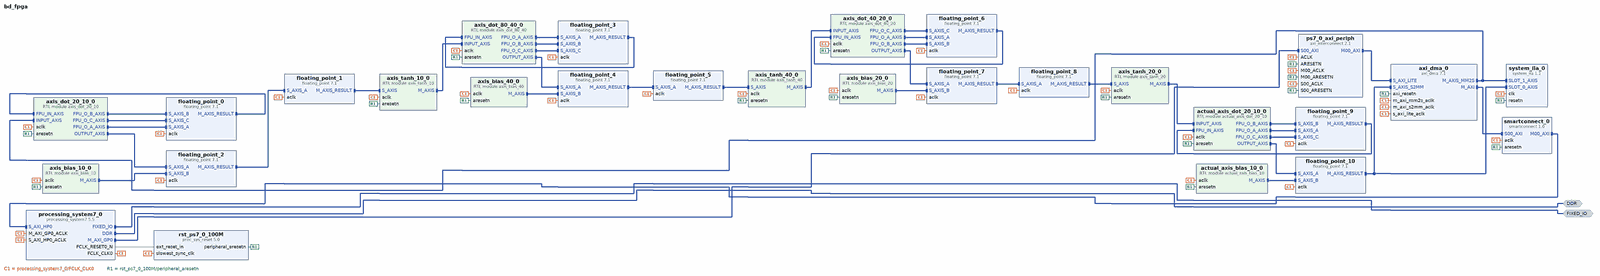
[diagram p0: block diagram of the top level, whole]
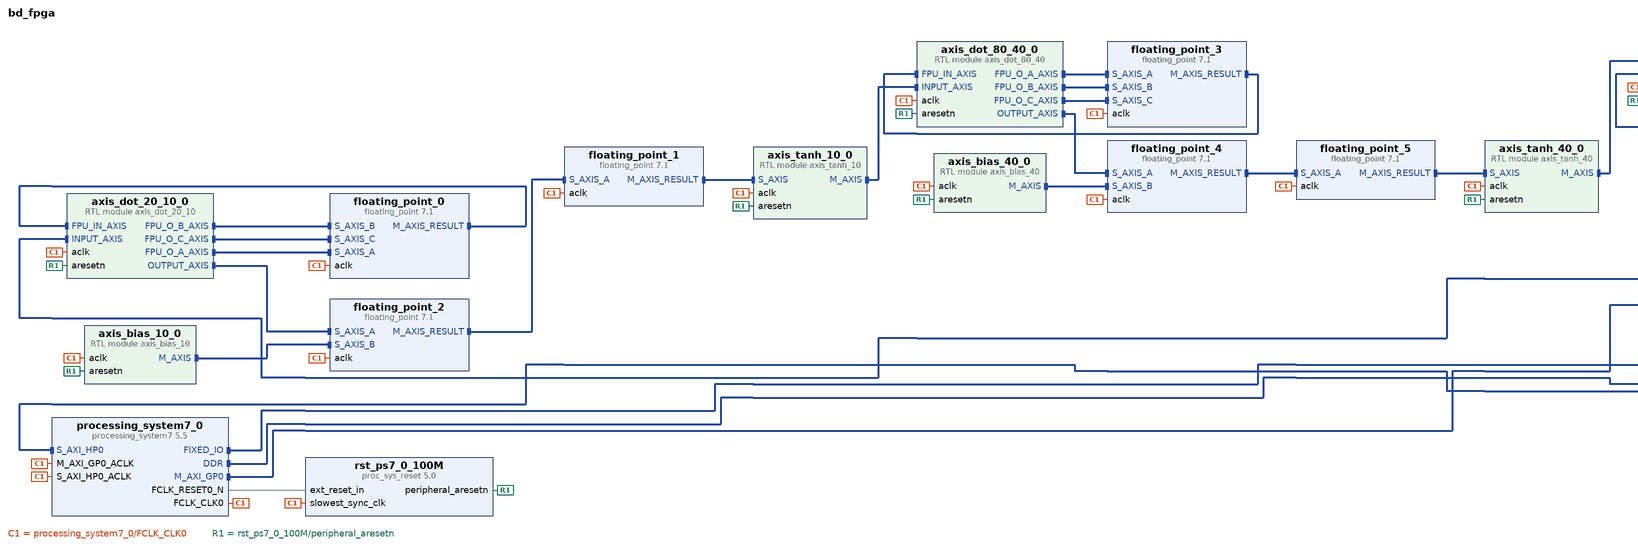
[diagram p1: block diagram of the top level, left part]
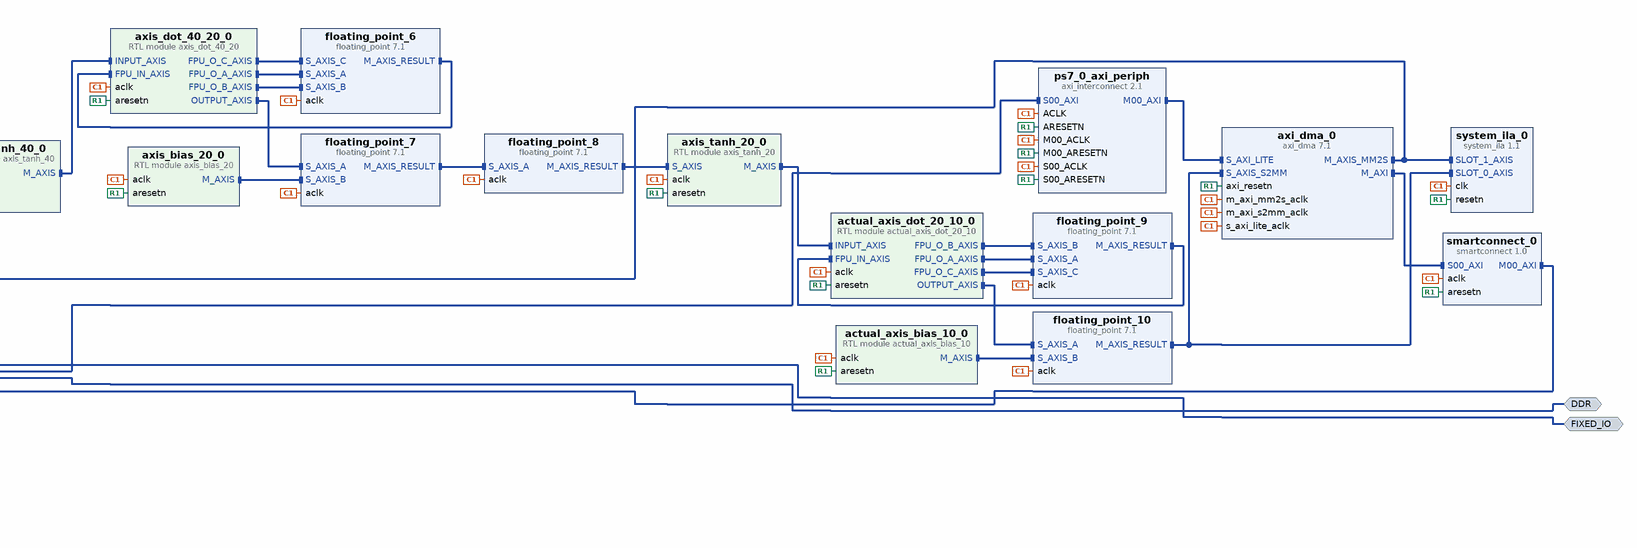
[diagram p2: block diagram of the top level, right part]
# Vivado block design bd_fpga, xc7z020clg400-1, Vivado 2018.3
create_bd_design bd_fpga

create_bd_intf_port -mode Master -vlnv xilinx.com:interface:ddrx_rtl:1.0 DDR
create_bd_intf_port -mode Master -vlnv xilinx.com:display_processing_system7:fixedio_rtl:1.0 FIXED_IO

create_bd_cell -type ip -vlnv xilinx.com:ip:processing_system7:5.5 processing_system7_0
set_property -dict [list \
  CONFIG.PCW_APU_PERIPHERAL_FREQMHZ 650 \
  CONFIG.PCW_CRYSTAL_PERIPHERAL_FREQMHZ 50 \
  CONFIG.PCW_ENET0_ENET0_IO {MIO 16 .. 27} \
  CONFIG.PCW_ENET0_GRP_MDIO_ENABLE 1 \
  CONFIG.PCW_ENET0_GRP_MDIO_IO {MIO 52 .. 53} \
  CONFIG.PCW_ENET0_PERIPHERAL_ENABLE 1 \
  CONFIG.PCW_ENET0_RESET_ENABLE 1 \
  CONFIG.PCW_ENET0_RESET_IO {MIO 9} \
  CONFIG.PCW_ENET_RESET_ENABLE 1 \
  CONFIG.PCW_ENET_RESET_SELECT {Share reset pin} \
  CONFIG.PCW_FPGA0_PERIPHERAL_FREQMHZ 100 \
  CONFIG.PCW_FPGA1_PERIPHERAL_FREQMHZ 50 \
  CONFIG.PCW_GPIO_MIO_GPIO_ENABLE 1 \
  CONFIG.PCW_GPIO_MIO_GPIO_IO MIO \
  CONFIG.PCW_I2C_RESET_ENABLE 1 \
  CONFIG.PCW_M_AXI_GP0_FREQMHZ 10 \
  CONFIG.PCW_PERIPHERAL_BOARD_PRESET None \
  CONFIG.PCW_PRESET_BANK1_VOLTAGE {LVCMOS 1.8V} \
  CONFIG.PCW_QSPI_GRP_FBCLK_ENABLE 1 \
  CONFIG.PCW_QSPI_GRP_FBCLK_IO {MIO 8} \
  CONFIG.PCW_QSPI_GRP_SINGLE_SS_ENABLE 1 \
  CONFIG.PCW_QSPI_GRP_SINGLE_SS_IO {MIO 1 .. 6} \
  CONFIG.PCW_QSPI_PERIPHERAL_ENABLE 1 \
  CONFIG.PCW_QSPI_QSPI_IO {MIO 1 .. 6} \
  CONFIG.PCW_SD0_GRP_CD_ENABLE 1 \
  CONFIG.PCW_SD0_GRP_CD_IO {MIO 47} \
  CONFIG.PCW_SD0_GRP_WP_ENABLE 0 \
  CONFIG.PCW_SD0_PERIPHERAL_ENABLE 1 \
  CONFIG.PCW_SD0_SD0_IO {MIO 40 .. 45} \
  CONFIG.PCW_SDIO_PERIPHERAL_FREQMHZ 50 \
  CONFIG.PCW_SINGLE_QSPI_DATA_MODE x4 \
  CONFIG.PCW_S_AXI_HP0_FREQMHZ 10 \
  CONFIG.PCW_UART0_PERIPHERAL_ENABLE 1 \
  CONFIG.PCW_UART0_UART0_IO {MIO 14 .. 15} \
  CONFIG.PCW_UART1_PERIPHERAL_ENABLE 0 \
  CONFIG.PCW_UART_PERIPHERAL_FREQMHZ 100 \
  CONFIG.PCW_UIPARAM_DDR_BUS_WIDTH {16 Bit} \
  CONFIG.PCW_UIPARAM_DDR_FREQ_MHZ 525 \
  CONFIG.PCW_UIPARAM_DDR_PARTNO {MT41J256M16 RE-125} \
  CONFIG.PCW_USB0_PERIPHERAL_ENABLE 1 \
  CONFIG.PCW_USB0_RESET_ENABLE 1 \
  CONFIG.PCW_USB0_RESET_IO {MIO 46} \
  CONFIG.PCW_USB0_USB0_IO {MIO 28 .. 39} \
  CONFIG.PCW_USB_RESET_ENABLE 1 \
  CONFIG.PCW_USB_RESET_SELECT {Share reset pin} \
  CONFIG.PCW_USE_S_AXI_HP0 1 \
] [get_bd_cells processing_system7_0]
# 482 more settings of processing_system7_0 are not shown: defaults, MIO pin electricals, DDR timing, and values the tool derives
create_bd_cell -type ip -vlnv xilinx.com:ip:floating_point:7.1 floating_point_0
set_property -dict [list \
  CONFIG.Add_Sub_Value Add \
  CONFIG.C_Latency 17 \
  CONFIG.C_Mult_Usage Medium_Usage \
  CONFIG.C_Rate 1 \
  CONFIG.C_Result_Exponent_Width 8 \
  CONFIG.C_Result_Fraction_Width 24 \
  CONFIG.Has_A_TLAST true \
  CONFIG.Operation_Type FMA \
  CONFIG.RESULT_TLAST_Behv Pass_A_TLAST \
  CONFIG.Result_Precision_Type Single \
] [get_bd_cells floating_point_0]
create_bd_cell -type ip -vlnv xilinx.com:ip:axi_dma:7.1 axi_dma_0
set_property -dict {CONFIG.c_include_sg 0 CONFIG.c_single_interface 1} [get_bd_cells axi_dma_0]
create_bd_cell -type ip -vlnv xilinx.com:ip:axi_interconnect:2.1 ps7_0_axi_periph
set_property -dict {CONFIG.NUM_MI 1} [get_bd_cells ps7_0_axi_periph]
create_bd_cell -type ip -vlnv xilinx.com:ip:proc_sys_reset:5.0 rst_ps7_0_100M
create_bd_cell -type ip -vlnv xilinx.com:ip:smartconnect:1.0 smartconnect_0
set_property -dict {CONFIG.NUM_SI 1} [get_bd_cells smartconnect_0]
create_bd_cell -type ip -vlnv xilinx.com:ip:system_ila:1.1 system_ila_0
set_property -dict [list \
  CONFIG.C_MON_TYPE INTERFACE \
  CONFIG.C_NUM_MONITOR_SLOTS 2 \
  CONFIG.C_SLOT_0_APC_EN 0 \
  CONFIG.C_SLOT_0_AXI_DATA_SEL 1 \
  CONFIG.C_SLOT_0_AXI_TRIG_SEL 1 \
  CONFIG.C_SLOT_0_INTF_TYPE xilinx.com:interface:axis_rtl:1.0 \
  CONFIG.C_SLOT_1_APC_EN 0 \
  CONFIG.C_SLOT_1_AXI_DATA_SEL 1 \
  CONFIG.C_SLOT_1_AXI_TRIG_SEL 1 \
  CONFIG.C_SLOT_1_INTF_TYPE xilinx.com:interface:axis_rtl:1.0 \
] [get_bd_cells system_ila_0]
create_bd_cell -type ip -vlnv xilinx.com:ip:floating_point:7.1 floating_point_2
set_property -dict [list \
  CONFIG.Add_Sub_Value Add \
  CONFIG.Has_A_TLAST true \
  CONFIG.RESULT_TLAST_Behv Pass_A_TLAST \
] [get_bd_cells floating_point_2]
create_bd_cell -type ip -vlnv xilinx.com:ip:floating_point:7.1 floating_point_1
set_property -dict [list \
  CONFIG.C_Accum_Input_Msb 32 \
  CONFIG.C_Accum_Lsb -31 \
  CONFIG.C_Accum_Msb 32 \
  CONFIG.C_Latency 7 \
  CONFIG.C_Mult_Usage No_Usage \
  CONFIG.C_Rate 1 \
  CONFIG.C_Result_Exponent_Width 16 \
  CONFIG.C_Result_Fraction_Width 16 \
  CONFIG.Flow_Control Blocking \
  CONFIG.Has_RESULT_TREADY true \
  CONFIG.Operation_Type Float_to_fixed \
  CONFIG.Result_Precision_Type Custom \
] [get_bd_cells floating_point_1]
create_bd_cell -type module -reference axis_dot_20_10 axis_dot_20_10_0
create_bd_cell -type module -reference axis_bias_10 axis_bias_10_0
create_bd_cell -type module -reference axis_tanh_10 axis_tanh_10_0
create_bd_cell -type module -reference axis_dot_80_40 axis_dot_80_40_0
create_bd_cell -type ip -vlnv xilinx.com:ip:floating_point:7.1 floating_point_3
set_property -dict [list \
  CONFIG.Add_Sub_Value Add \
  CONFIG.C_Latency 17 \
  CONFIG.C_Mult_Usage Medium_Usage \
  CONFIG.C_Rate 1 \
  CONFIG.C_Result_Exponent_Width 8 \
  CONFIG.C_Result_Fraction_Width 24 \
  CONFIG.Has_A_TLAST true \
  CONFIG.Operation_Type FMA \
  CONFIG.RESULT_TLAST_Behv Pass_A_TLAST \
  CONFIG.Result_Precision_Type Single \
] [get_bd_cells floating_point_3]
create_bd_cell -type module -reference axis_bias_40 axis_bias_40_0
create_bd_cell -type ip -vlnv xilinx.com:ip:floating_point:7.1 floating_point_4
set_property -dict [list \
  CONFIG.Add_Sub_Value Add \
  CONFIG.Has_A_TLAST true \
  CONFIG.RESULT_TLAST_Behv Pass_A_TLAST \
] [get_bd_cells floating_point_4]
create_bd_cell -type ip -vlnv xilinx.com:ip:floating_point:7.1 floating_point_5
set_property -dict [list \
  CONFIG.C_Accum_Input_Msb 32 \
  CONFIG.C_Accum_Lsb -31 \
  CONFIG.C_Accum_Msb 32 \
  CONFIG.C_Latency 7 \
  CONFIG.C_Mult_Usage No_Usage \
  CONFIG.C_Rate 1 \
  CONFIG.C_Result_Exponent_Width 16 \
  CONFIG.C_Result_Fraction_Width 16 \
  CONFIG.Flow_Control Blocking \
  CONFIG.Has_RESULT_TREADY true \
  CONFIG.Operation_Type Float_to_fixed \
  CONFIG.Result_Precision_Type Custom \
] [get_bd_cells floating_point_5]
create_bd_cell -type module -reference axis_tanh_40 axis_tanh_40_0
create_bd_cell -type module -reference axis_dot_40_20 axis_dot_40_20_0
create_bd_cell -type ip -vlnv xilinx.com:ip:floating_point:7.1 floating_point_6
set_property -dict [list \
  CONFIG.Add_Sub_Value Add \
  CONFIG.C_Latency 17 \
  CONFIG.C_Mult_Usage Medium_Usage \
  CONFIG.C_Rate 1 \
  CONFIG.C_Result_Exponent_Width 8 \
  CONFIG.C_Result_Fraction_Width 24 \
  CONFIG.Has_A_TLAST true \
  CONFIG.Operation_Type FMA \
  CONFIG.RESULT_TLAST_Behv Pass_A_TLAST \
  CONFIG.Result_Precision_Type Single \
] [get_bd_cells floating_point_6]
create_bd_cell -type ip -vlnv xilinx.com:ip:floating_point:7.1 floating_point_7
set_property -dict [list \
  CONFIG.Add_Sub_Value Add \
  CONFIG.Has_A_TLAST true \
  CONFIG.RESULT_TLAST_Behv Pass_A_TLAST \
] [get_bd_cells floating_point_7]
create_bd_cell -type ip -vlnv xilinx.com:ip:floating_point:7.1 floating_point_8
set_property -dict [list \
  CONFIG.C_Accum_Input_Msb 32 \
  CONFIG.C_Accum_Lsb -31 \
  CONFIG.C_Accum_Msb 32 \
  CONFIG.C_Latency 7 \
  CONFIG.C_Mult_Usage No_Usage \
  CONFIG.C_Rate 1 \
  CONFIG.C_Result_Exponent_Width 16 \
  CONFIG.C_Result_Fraction_Width 16 \
  CONFIG.Flow_Control Blocking \
  CONFIG.Has_RESULT_TREADY true \
  CONFIG.Operation_Type Float_to_fixed \
  CONFIG.Result_Precision_Type Custom \
] [get_bd_cells floating_point_8]
create_bd_cell -type module -reference axis_bias_20 axis_bias_20_0
create_bd_cell -type module -reference axis_tanh_20 axis_tanh_20_0
create_bd_cell -type module -reference actual_axis_dot_20_10 actual_axis_dot_20_10_0
create_bd_cell -type module -reference actual_axis_bias_10 actual_axis_bias_10_0
create_bd_cell -type ip -vlnv xilinx.com:ip:floating_point:7.1 floating_point_9
set_property -dict [list \
  CONFIG.Add_Sub_Value Add \
  CONFIG.C_Latency 17 \
  CONFIG.C_Mult_Usage Medium_Usage \
  CONFIG.C_Rate 1 \
  CONFIG.C_Result_Exponent_Width 8 \
  CONFIG.C_Result_Fraction_Width 24 \
  CONFIG.Has_A_TLAST true \
  CONFIG.Operation_Type FMA \
  CONFIG.RESULT_TLAST_Behv Pass_A_TLAST \
  CONFIG.Result_Precision_Type Single \
] [get_bd_cells floating_point_9]
create_bd_cell -type ip -vlnv xilinx.com:ip:floating_point:7.1 floating_point_10
set_property -dict [list \
  CONFIG.Add_Sub_Value Add \
  CONFIG.Has_A_TLAST true \
  CONFIG.RESULT_TLAST_Behv Pass_A_TLAST \
] [get_bd_cells floating_point_10]

# ---- connections ----

connect_bd_intf_net [get_bd_intf_pins axis_bias_10_0/M_AXIS] [get_bd_intf_pins floating_point_2/S_AXIS_B]
connect_bd_intf_net -intf_net axi_dma_0_M_AXIS_MM2S [get_bd_intf_pins axi_dma_0/M_AXIS_MM2S] [get_bd_intf_pins axis_dot_20_10_0/INPUT_AXIS]
connect_bd_intf_net [get_bd_intf_pins axi_dma_0/M_AXIS_MM2S] [get_bd_intf_pins system_ila_0/SLOT_1_AXIS]
connect_bd_intf_net [get_bd_intf_pins floating_point_2/M_AXIS_RESULT] [get_bd_intf_pins floating_point_1/S_AXIS_A]
connect_bd_intf_net [get_bd_intf_pins floating_point_0/M_AXIS_RESULT] [get_bd_intf_pins axis_dot_20_10_0/FPU_IN_AXIS]
connect_bd_intf_net [get_bd_intf_ports FIXED_IO] [get_bd_intf_pins processing_system7_0/FIXED_IO]
connect_bd_intf_net [get_bd_intf_pins ps7_0_axi_periph/M00_AXI] [get_bd_intf_pins axi_dma_0/S_AXI_LITE]
connect_bd_intf_net [get_bd_intf_pins axis_dot_20_10_0/OUTPUT_AXIS] [get_bd_intf_pins floating_point_2/S_AXIS_A]
connect_bd_intf_net [get_bd_intf_pins floating_point_1/M_AXIS_RESULT] [get_bd_intf_pins axis_tanh_10_0/S_AXIS]
connect_bd_intf_net [get_bd_intf_ports DDR] [get_bd_intf_pins processing_system7_0/DDR]
connect_bd_intf_net [get_bd_intf_pins processing_system7_0/M_AXI_GP0] [get_bd_intf_pins ps7_0_axi_periph/S00_AXI]
connect_bd_intf_net [get_bd_intf_pins axis_dot_20_10_0/FPU_O_B_AXIS] [get_bd_intf_pins floating_point_0/S_AXIS_B]
connect_bd_intf_net [get_bd_intf_pins axi_dma_0/M_AXI] [get_bd_intf_pins smartconnect_0/S00_AXI]
connect_bd_intf_net [get_bd_intf_pins axis_dot_20_10_0/FPU_O_C_AXIS] [get_bd_intf_pins floating_point_0/S_AXIS_C]
connect_bd_intf_net [get_bd_intf_pins smartconnect_0/M00_AXI] [get_bd_intf_pins processing_system7_0/S_AXI_HP0]
connect_bd_intf_net [get_bd_intf_pins axis_dot_20_10_0/FPU_O_A_AXIS] [get_bd_intf_pins floating_point_0/S_AXIS_A]
connect_bd_intf_net [get_bd_intf_pins actual_axis_dot_20_10_0/OUTPUT_AXIS] [get_bd_intf_pins floating_point_10/S_AXIS_A]
connect_bd_intf_net [get_bd_intf_pins actual_axis_bias_10_0/M_AXIS] [get_bd_intf_pins floating_point_10/S_AXIS_B]
connect_bd_intf_net [get_bd_intf_pins actual_axis_dot_20_10_0/INPUT_AXIS] [get_bd_intf_pins axis_tanh_20_0/M_AXIS]
connect_bd_intf_net [get_bd_intf_pins floating_point_5/M_AXIS_RESULT] [get_bd_intf_pins axis_tanh_40_0/S_AXIS]
connect_bd_intf_net [get_bd_intf_pins axis_dot_40_20_0/FPU_O_C_AXIS] [get_bd_intf_pins floating_point_6/S_AXIS_C]
connect_bd_intf_net [get_bd_intf_pins axis_bias_20_0/M_AXIS] [get_bd_intf_pins floating_point_7/S_AXIS_B]
connect_bd_intf_net [get_bd_intf_pins floating_point_4/M_AXIS_RESULT] [get_bd_intf_pins floating_point_5/S_AXIS_A]
connect_bd_intf_net [get_bd_intf_pins axis_dot_80_40_0/OUTPUT_AXIS] [get_bd_intf_pins floating_point_4/S_AXIS_A]
connect_bd_intf_net [get_bd_intf_pins axis_tanh_10_0/M_AXIS] [get_bd_intf_pins axis_dot_80_40_0/INPUT_AXIS]
connect_bd_intf_net [get_bd_intf_pins axis_bias_40_0/M_AXIS] [get_bd_intf_pins floating_point_4/S_AXIS_B]
connect_bd_intf_net [get_bd_intf_pins floating_point_3/M_AXIS_RESULT] [get_bd_intf_pins axis_dot_80_40_0/FPU_IN_AXIS]
connect_bd_intf_net [get_bd_intf_pins axis_dot_80_40_0/FPU_O_A_AXIS] [get_bd_intf_pins floating_point_3/S_AXIS_A]
connect_bd_intf_net [get_bd_intf_pins axis_dot_80_40_0/FPU_O_B_AXIS] [get_bd_intf_pins floating_point_3/S_AXIS_B]
connect_bd_intf_net [get_bd_intf_pins axis_dot_80_40_0/FPU_O_C_AXIS] [get_bd_intf_pins floating_point_3/S_AXIS_C]
connect_bd_intf_net [get_bd_intf_pins actual_axis_dot_20_10_0/FPU_O_B_AXIS] [get_bd_intf_pins floating_point_9/S_AXIS_B]
connect_bd_intf_net [get_bd_intf_pins floating_point_7/M_AXIS_RESULT] [get_bd_intf_pins floating_point_8/S_AXIS_A]
connect_bd_intf_net [get_bd_intf_pins axis_tanh_40_0/M_AXIS] [get_bd_intf_pins axis_dot_40_20_0/INPUT_AXIS]
connect_bd_intf_net [get_bd_intf_pins axis_dot_40_20_0/FPU_O_A_AXIS] [get_bd_intf_pins floating_point_6/S_AXIS_A]
connect_bd_intf_net [get_bd_intf_pins actual_axis_dot_20_10_0/FPU_O_A_AXIS] [get_bd_intf_pins floating_point_9/S_AXIS_A]
connect_bd_intf_net [get_bd_intf_pins floating_point_9/M_AXIS_RESULT] [get_bd_intf_pins actual_axis_dot_20_10_0/FPU_IN_AXIS]
connect_bd_intf_net [get_bd_intf_pins axis_dot_40_20_0/FPU_O_B_AXIS] [get_bd_intf_pins floating_point_6/S_AXIS_B]
connect_bd_intf_net [get_bd_intf_pins axis_dot_40_20_0/OUTPUT_AXIS] [get_bd_intf_pins floating_point_7/S_AXIS_A]
connect_bd_intf_net [get_bd_intf_pins floating_point_8/M_AXIS_RESULT] [get_bd_intf_pins axis_tanh_20_0/S_AXIS]
connect_bd_intf_net [get_bd_intf_pins floating_point_6/M_AXIS_RESULT] [get_bd_intf_pins axis_dot_40_20_0/FPU_IN_AXIS]
connect_bd_intf_net [get_bd_intf_pins actual_axis_dot_20_10_0/FPU_O_C_AXIS] [get_bd_intf_pins floating_point_9/S_AXIS_C]
connect_bd_intf_net -intf_net floating_point_10_M_AXIS_RESULT [get_bd_intf_pins axi_dma_0/S_AXIS_S2MM] [get_bd_intf_pins floating_point_10/M_AXIS_RESULT]
connect_bd_intf_net [get_bd_intf_pins axi_dma_0/S_AXIS_S2MM] [get_bd_intf_pins system_ila_0/SLOT_0_AXIS]
connect_bd_net [get_bd_pins processing_system7_0/FCLK_CLK0] \
  [get_bd_pins processing_system7_0/M_AXI_GP0_ACLK] [get_bd_pins ps7_0_axi_periph/S00_ACLK] \
  [get_bd_pins rst_ps7_0_100M/slowest_sync_clk] [get_bd_pins axi_dma_0/s_axi_lite_aclk] \
  [get_bd_pins ps7_0_axi_periph/M00_ACLK] [get_bd_pins ps7_0_axi_periph/ACLK] \
  [get_bd_pins processing_system7_0/S_AXI_HP0_ACLK] [get_bd_pins smartconnect_0/aclk] [get_bd_pins floating_point_0/aclk] \
  [get_bd_pins axi_dma_0/m_axi_mm2s_aclk] [get_bd_pins axi_dma_0/m_axi_s2mm_aclk] [get_bd_pins system_ila_0/clk] \
  [get_bd_pins floating_point_2/aclk] [get_bd_pins floating_point_1/aclk] [get_bd_pins axis_dot_20_10_0/aclk] \
  [get_bd_pins axis_bias_10_0/aclk] [get_bd_pins axis_tanh_10_0/aclk] [get_bd_pins axis_dot_80_40_0/aclk] \
  [get_bd_pins floating_point_3/aclk] [get_bd_pins floating_point_4/aclk] [get_bd_pins axis_bias_40_0/aclk] \
  [get_bd_pins floating_point_5/aclk] [get_bd_pins axis_tanh_40_0/aclk] [get_bd_pins axis_dot_40_20_0/aclk] \
  [get_bd_pins floating_point_6/aclk] [get_bd_pins floating_point_7/aclk] [get_bd_pins floating_point_8/aclk] \
  [get_bd_pins axis_tanh_20_0/aclk] [get_bd_pins axis_bias_20_0/aclk] [get_bd_pins actual_axis_dot_20_10_0/aclk] \
  [get_bd_pins floating_point_9/aclk] [get_bd_pins floating_point_10/aclk] [get_bd_pins actual_axis_bias_10_0/aclk]
connect_bd_net [get_bd_pins processing_system7_0/FCLK_RESET0_N] [get_bd_pins rst_ps7_0_100M/ext_reset_in]
connect_bd_net [get_bd_pins rst_ps7_0_100M/peripheral_aresetn] \
  [get_bd_pins ps7_0_axi_periph/S00_ARESETN] [get_bd_pins axi_dma_0/axi_resetn] [get_bd_pins ps7_0_axi_periph/M00_ARESETN] \
  [get_bd_pins ps7_0_axi_periph/ARESETN] [get_bd_pins smartconnect_0/aresetn] [get_bd_pins system_ila_0/resetn] \
  [get_bd_pins axis_dot_20_10_0/aresetn] [get_bd_pins axis_bias_10_0/aresetn] [get_bd_pins axis_tanh_10_0/aresetn] \
  [get_bd_pins axis_dot_80_40_0/aresetn] [get_bd_pins axis_bias_40_0/aresetn] [get_bd_pins axis_tanh_40_0/aresetn] \
  [get_bd_pins axis_dot_40_20_0/aresetn] [get_bd_pins axis_tanh_20_0/aresetn] [get_bd_pins axis_bias_20_0/aresetn] \
  [get_bd_pins actual_axis_dot_20_10_0/aresetn] [get_bd_pins actual_axis_bias_10_0/aresetn]
set_property HDL_ATTRIBUTE.DEBUG true [get_bd_intf_nets axi_dma_0_M_AXIS_MM2S]
set_property HDL_ATTRIBUTE.MARK_DEBUG true [get_bd_intf_nets axi_dma_0_M_AXIS_MM2S]
set_property HDL_ATTRIBUTE.DEBUG true [get_bd_intf_nets floating_point_10_M_AXIS_RESULT]
set_property HDL_ATTRIBUTE.MARK_DEBUG true [get_bd_intf_nets floating_point_10_M_AXIS_RESULT]

# ---- address map ----
assign_bd_address -offset 0x00000000 -range 512M -target_address_space [get_bd_addr_spaces axi_dma_0/Data] [get_bd_addr_segs processing_system7_0/S_AXI_HP0/HP0_DDR_LOWOCM]
assign_bd_address -offset 0x40400000 -range 64K -target_address_space [get_bd_addr_spaces processing_system7_0/Data] [get_bd_addr_segs axi_dma_0/S_AXI_LITE/Reg]

validate_bd_design
save_bd_design
